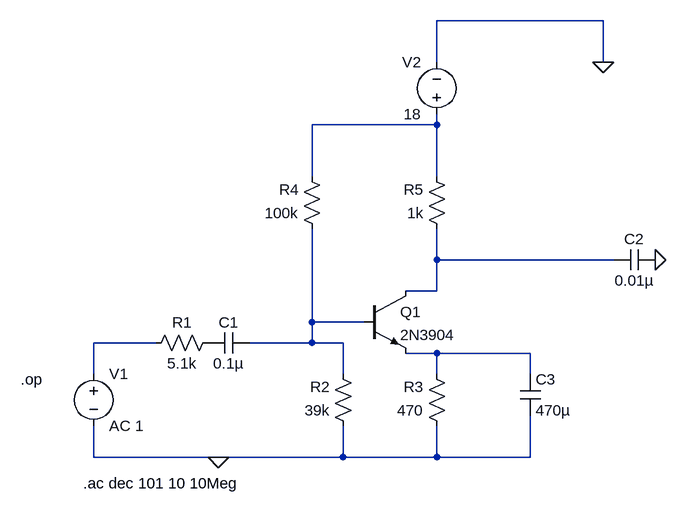
[diagram p0: schematic EXP-3_RConeSTAGE.asc]
EXP-3_RConeSTAGE.asc, the LTspice schematic file:
Version 4
SHEET 1 880 680
WIRE 752 -336 496 -336
WIRE 496 -272 496 -336
WIRE 752 -272 752 -336
WIRE 496 -176 496 -192
WIRE 496 -176 304 -176
WIRE 304 -96 304 -176
WIRE 496 -96 496 -176
WIRE 496 32 496 -16
WIRE 768 32 496 32
WIRE 496 80 496 32
WIRE 496 80 448 80
WIRE 304 128 304 -16
WIRE 384 128 304 128
WIRE 64 160 -32 160
WIRE 304 160 304 128
WIRE 304 160 208 160
WIRE 352 160 304 160
WIRE 496 176 448 176
WIRE 640 176 496 176
WIRE -32 208 -32 160
WIRE 352 208 352 160
WIRE 496 208 496 176
WIRE 640 208 640 176
WIRE -32 336 -32 288
WIRE 160 336 -32 336
WIRE 352 336 352 288
WIRE 352 336 160 336
WIRE 496 336 496 288
WIRE 496 336 352 336
WIRE 640 336 640 272
WIRE 640 336 496 336
FLAG 752 -272 0
FLAG 832 32 0
FLAG 160 336 0
SYMBOL voltage -32 192 R0
WINDOW 123 0 0 Left 0
WINDOW 39 0 0 Left 0
SYMATTR InstName V1
SYMATTR Value AC 1
SYMBOL res 160 144 R90
WINDOW 0 0 56 VBottom 2
WINDOW 3 32 56 VTop 2
SYMATTR InstName R1
SYMATTR Value 5.1k
SYMBOL res 368 304 R180
WINDOW 0 36 76 Left 2
WINDOW 3 36 40 Left 2
SYMATTR InstName R2
SYMATTR Value 39k
SYMBOL res 512 304 R180
WINDOW 0 36 76 Left 2
WINDOW 3 36 40 Left 2
SYMATTR InstName R3
SYMATTR Value 470
SYMBOL res 320 0 R180
WINDOW 0 36 76 Left 2
WINDOW 3 36 40 Left 2
SYMATTR InstName R4
SYMATTR Value 100k
SYMBOL res 512 0 R180
WINDOW 0 36 76 Left 2
WINDOW 3 36 40 Left 2
SYMATTR InstName R5
SYMATTR Value 1k
SYMBOL cap 208 144 R90
WINDOW 0 0 32 VBottom 2
WINDOW 3 32 32 VTop 2
SYMATTR InstName C1
SYMATTR Value 0.1µ
SYMBOL npn 384 80 R0
SYMATTR InstName Q1
SYMATTR Value 2N3904
SYMBOL voltage 496 -176 R180
WINDOW 0 24 96 Left 2
WINDOW 3 24 16 Left 2
WINDOW 123 0 0 Left 0
WINDOW 39 0 0 Left 0
SYMATTR InstName V2
SYMATTR Value 18
SYMBOL cap 832 16 R90
WINDOW 0 0 32 VBottom 2
WINDOW 3 32 32 VTop 2
SYMATTR InstName C2
SYMATTR Value 0.01µ
SYMBOL cap 624 208 R0
SYMATTR InstName C3
SYMATTR Value 470µ
TEXT -48 376 Left 2 !.ac dec 101 10 10Meg
TEXT -144 216 Left 2 !.op

The netlist it stands for:
* EXP-3_RConeSTAGE.asc
V1 N004 0 AC 1
R1 P001 N004 5.1k
R2 0 N003 39k
R3 0 N005 470
R4 N003 N001 100k
R5 N002 N001 1k
C1 N003 P001 0.1µ
Q1 N002 N003 N005 0 2N3904
V2 N001 0 18
C2 0 N002 0.01µ
C3 N005 0 470µ
.model NPN NPN
.model PNP PNP
.lib standard.bjt
.ac dec 101 10 10Meg
.op
.backanno
.end